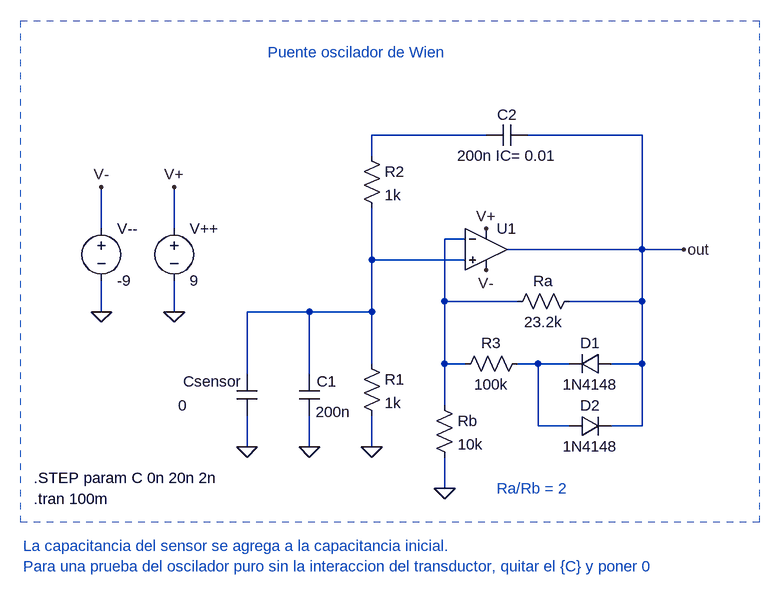
[diagram p0: schematic wien_bridge.asc]
wien_bridge.asc, the LTspice schematic file:
Version 4
SHEET 1 1080 680
WIRE 656 -64 480 -64
WIRE 896 -64 720 -64
WIRE 480 -32 480 -64
WIRE 64 80 64 16
WIRE 176 80 176 16
WIRE 624 96 592 96
WIRE 896 112 896 -64
WIRE 896 112 688 112
WIRE 960 112 896 112
WIRE 480 128 480 48
WIRE 624 128 480 128
WIRE 592 192 592 96
WIRE 704 192 592 192
WIRE 896 192 896 112
WIRE 896 192 784 192
WIRE 64 208 64 160
WIRE 176 208 176 160
WIRE 384 208 288 208
WIRE 480 208 480 128
WIRE 480 208 384 208
WIRE 480 288 480 208
WIRE 592 288 592 192
WIRE 624 288 592 288
WIRE 736 288 704 288
WIRE 784 288 736 288
WIRE 896 288 896 192
WIRE 896 288 848 288
WIRE 288 304 288 208
WIRE 384 304 384 208
WIRE 592 352 592 288
WIRE 736 384 736 288
WIRE 784 384 736 384
WIRE 896 384 896 288
WIRE 896 384 848 384
WIRE 288 416 288 368
WIRE 384 416 384 368
WIRE 480 416 480 368
WIRE 592 480 592 432
FLAG 176 208 0
FLAG 176 16 V+
FLAG 64 208 0
FLAG 64 16 V-
FLAG 480 416 0
FLAG 384 416 0
FLAG 592 480 0
FLAG 656 80 V+
FLAG 656 144 V-
FLAG 288 416 0
FLAG 960 112 out
SYMBOL voltage 176 64 R0
SYMATTR InstName V++
SYMATTR Value 9
SYMBOL voltage 64 64 R0
SYMATTR InstName V--
SYMATTR Value -9
SYMBOL Res 464 272 R0
SYMATTR InstName R1
SYMATTR Value 1k
SYMBOL Cap 368 304 R0
WINDOW 0 27 11 Left 2
WINDOW 3 26 58 Left 2
SYMATTR InstName C1
SYMATTR Value 200n
SYMBOL Res 464 -48 R0
SYMATTR InstName R2
SYMATTR Value 1k
SYMBOL Cap 720 -80 R90
WINDOW 0 0 32 VBottom 2
WINDOW 3 32 32 VTop 2
SYMATTR InstName C2
SYMATTR Value 200n IC= 0.01
SYMBOL Res 576 336 R0
SYMATTR InstName Rb
SYMATTR Value 10k
SYMBOL Res 800 176 R90
WINDOW 0 0 56 VBottom 2
WINDOW 3 32 56 VTop 2
SYMATTR InstName Ra
SYMATTR Value 23.2k
SYMBOL diode 848 272 R90
WINDOW 0 0 32 VBottom 2
WINDOW 3 32 32 VTop 2
SYMATTR InstName D1
SYMATTR Value 1N4148
SYMBOL diode 784 400 R270
WINDOW 0 32 32 VTop 2
WINDOW 3 0 32 VBottom 2
SYMATTR InstName D2
SYMATTR Value 1N4148
SYMBOL Res 720 272 R90
WINDOW 0 0 56 VBottom 2
WINDOW 3 32 56 VTop 2
SYMATTR InstName R3
SYMATTR Value 100k
SYMBOL OpAmps/UniversalOpAmp2 656 112 R0
SYMATTR InstName U1
SYMATTR Value2 Avol=2Meg GBW=10Meg Slew=10Meg
SYMATTR SpiceLine Ilimit=250m Rail=0 Vos=0
SYMBOL Cap 272 304 R0
WINDOW 0 -82 11 Left 2
WINDOW 3 -90 48 Left 2
SYMATTR InstName Csensor
SYMATTR Value 0
TEXT 672 480 Left 2 ;Ra/Rb = 2
TEXT -40 496 Left 2 !.tran 100m
TEXT 320 -192 Left 2 ;Puente oscilador de Wien
TEXT -40 464 Left 2 !.STEP param C 0n 20n 2n
TEXT -56 568 Left 2 ;La capacitancia del sensor se agrega a la capacitancia inicial.
TEXT -56 600 Left 2 ;Para una prueba del oscilador puro sin la interaccion del transductor, quitar el {C} y poner 0
RECTANGLE Normal -60 -240 1076 532 2

The netlist it stands for:
* wien_bridge.asc
V++ V+ 0 9
V-- V- 0 -9
R1 N003 0 1k
C1 N003 0 200n
R2 N001 N003 1k
C2 out N001 200n IC= 0.01
Rb N002 0 10k
Ra out N002 23.2k
D1 out N004 1N4148
D2 N004 out 1N4148
R3 N004 N002 100k
XU1 N003 N002 V+ V- out level2 Avol=2Meg GBW=10Meg Slew=10Meg Ilimit=250m Rail=0 Vos=0 En=0 Enk=0 In=0 Ink=0 Rin=500Meg  ; pins In+ In- V+ V- OUT
Csensor N003 0 0
.model D D
.lib standard.dio
* Ra/Rb = 2
.tran 100m
* Puente oscilador de Wien
.STEP param C 0n 20n 2n
* La capacitancia del sensor se agrega a la capacitancia inicial.
* Para una prueba del oscilador puro sin la interaccion del transductor, quitar el {C} y poner 0
.lib UniversalOpAmp2.lib
.backanno
.end